# EAGLE design Teilentwurf (EAGLE 6.5.0)
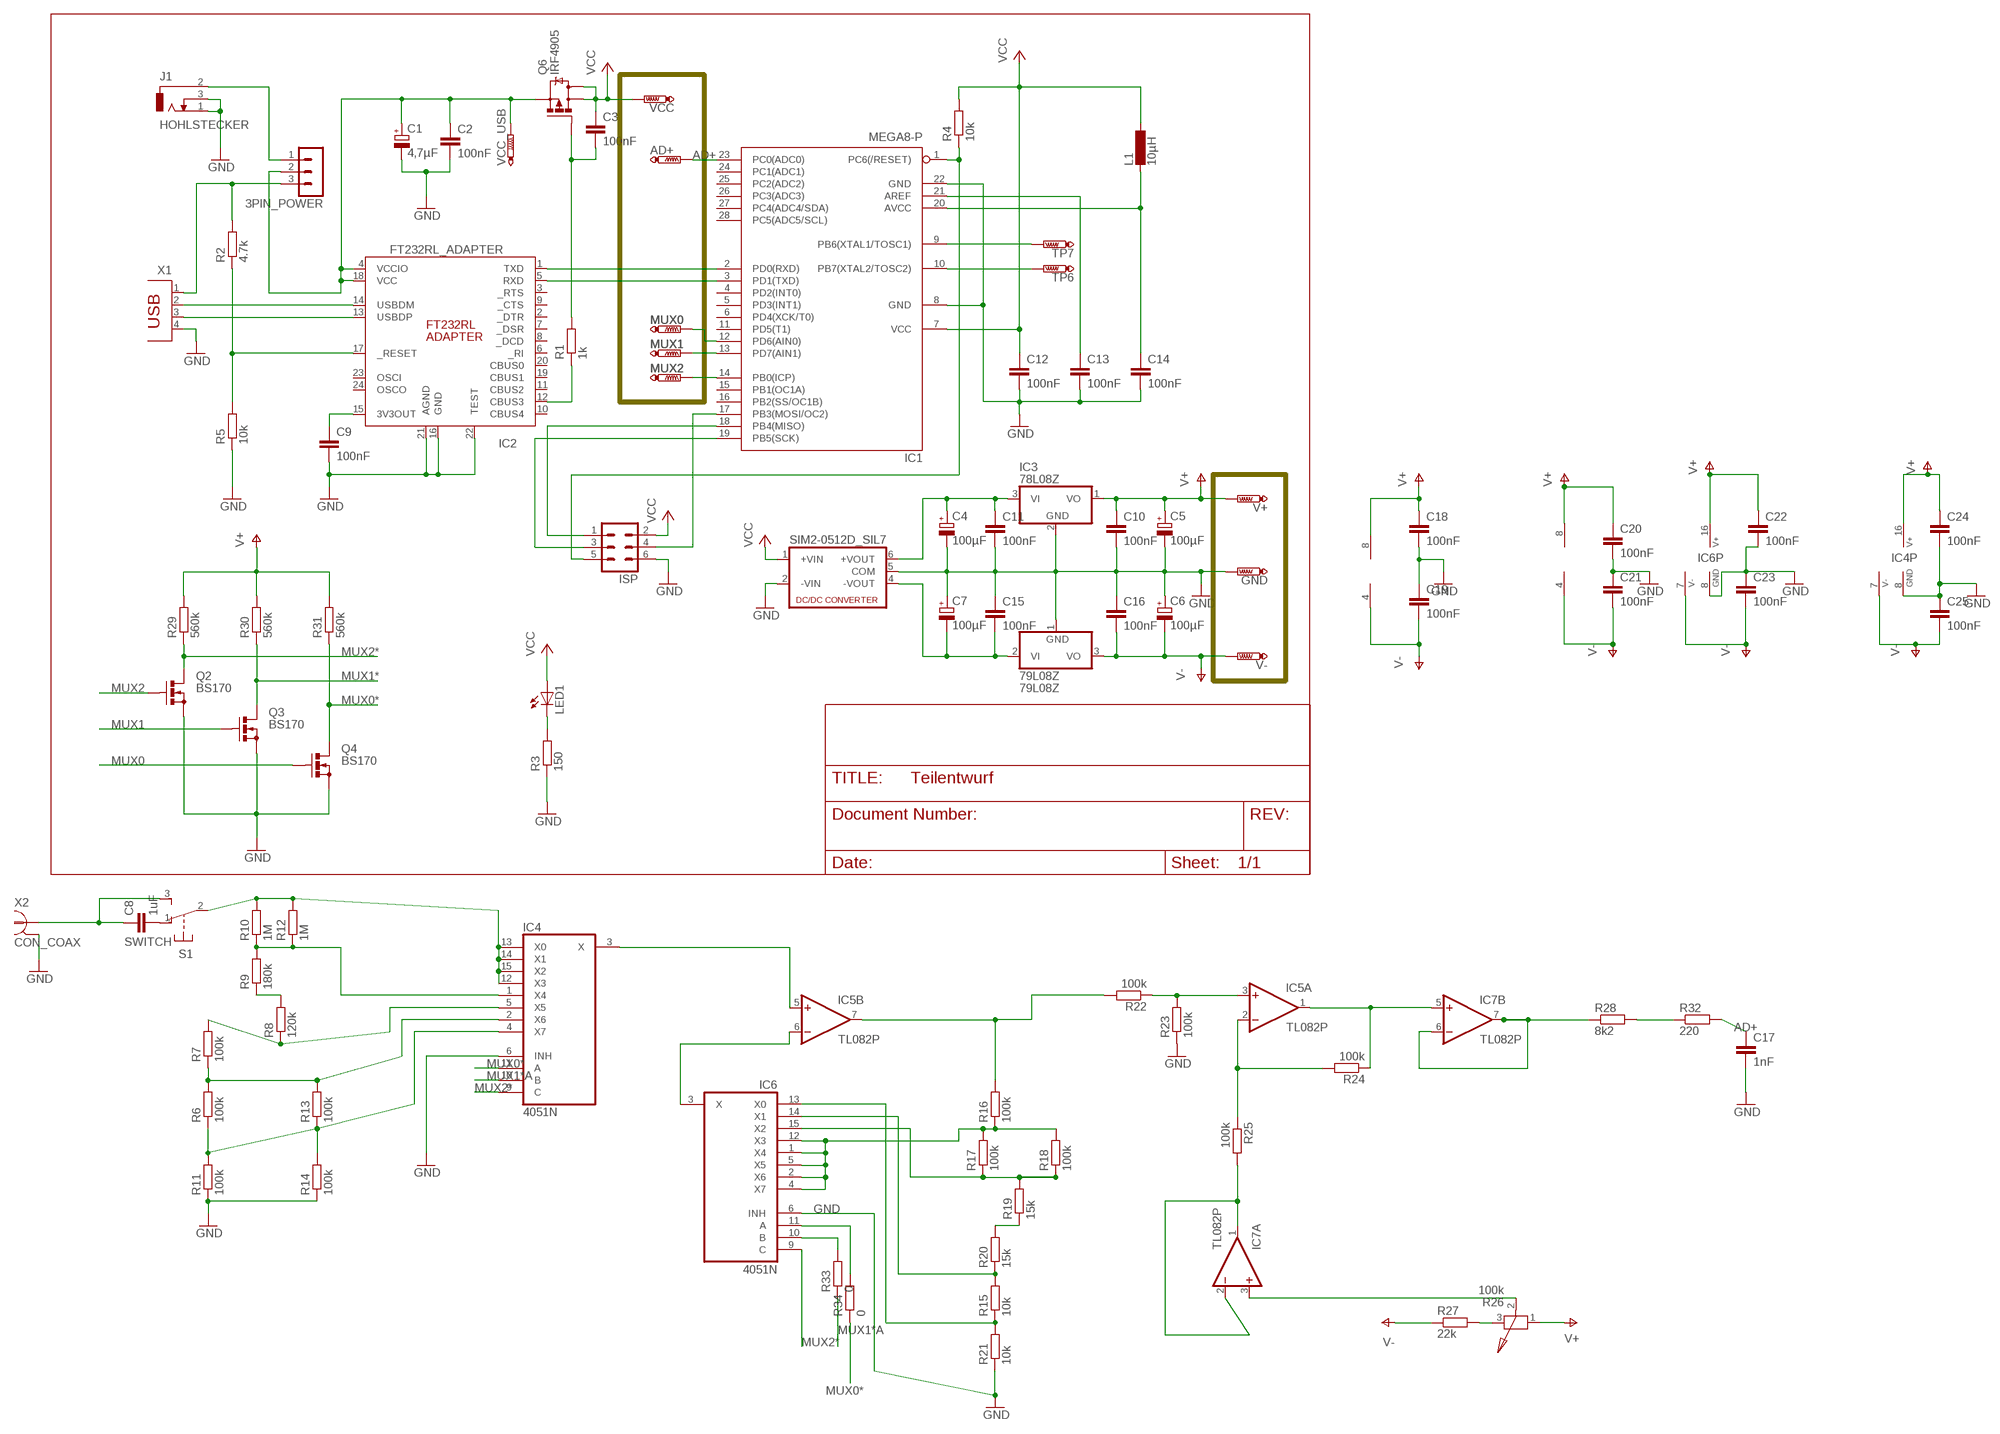
[diagram p0: schematic, sheet 1]

## Parts
3PIN_POWER  MA03-1  [MA03-1]
79L08Z  79L08Z  [TO92]
AD+  PTR1PAD1-13Y  [P1-13Y]
C1  4,7µF  CPOL-EUE2-5  [E2-5]
C2  100nF  C-EU025-030X050  [C025-030X050]
C3  100nF  C-EU025-030X050  [C025-030X050]
C4  100µF  CPOL-EUE2.5-7  [E2,5-7]
C5  100µF  CPOL-EUE2.5-7  [E2,5-7]
C6  100µF  CPOL-EUE2.5-7  [E2,5-7]
C7  100µF  CPOL-EUE2.5-7  [E2,5-7]
C8  1uF  C-EU050-050X075  [C050-050X075]
C9  100nF  C-EU025-030X050  [C025-030X050]
C10  100nF  C-EU025-030X050  [C025-030X050]
C11  100nF  C-EU025-030X050  [C025-030X050]
C12  100nF  C-EU025-030X050  [C025-030X050]
C13  100nF  C-EU025-030X050  [C025-030X050]
C14  100nF  C-EU025-030X050  [C025-030X050]
C15  100nF  C-EU025-030X050  [C025-030X050]
C16  100nF  C-EU025-030X050  [C025-030X050]
C17  1nF  C-EU025-030X050  [C025-030X050]
C18  100nF  C-EU025-030X050  [C025-030X050]
C19  100nF  C-EU025-030X050  [C025-030X050]
C20  100nF  C-EU025-030X050  [C025-030X050]
C21  100nF  C-EU025-030X050  [C025-030X050]
C22  100nF  C-EU025-030X050  [C025-030X050]
C23  100nF  C-EU025-030X050  [C025-030X050]
C24  100nF  C-EU025-030X050  [C025-030X050]
C25  100nF  C-EU025-030X050  [C025-030X050]
GND  PTR1PAD1-13Y  [P1-13Y]
IC1  MEGA8-P  [DIL28-3]
IC2  FT232RL_ADAPTER  [DIL24-9]
IC3  78L08Z  [TO92]
IC4  4051N  [DIL16]
IC5  TL082P  [DIL08]
IC6  4051N  [DIL16]
IC7  TL082P  [DIL08]
ISP  ML6  [ML6]
J1  HOHLSTECKER  [HOHLSTECKER_25]
L1  10µH  L-EU0207/12  [0207/12]
LED1  LED3MM  [LED3MM]
MUX0  PTR1PAD1-13Y  [P1-13Y]
MUX1  PTR1PAD1-13Y  [P1-13Y]
MUX2  PTR1PAD1-13Y  [P1-13Y]
Q2  BS170  [SOT54E]
Q3  BS170  [SOT54E]
Q4  BS170  [SOT54E]
Q6  IRF4905  IRF4905PBF  [TO220PAD]
R1  1k  R-EU_0207/10  [0207/10]
R2  4.7k  R-EU_0207/10  [0207/10]
R3  150  R-EU_0207/10  [0207/10]
R4  10k  R-EU_0207/12  [0207/12]
R5  10k  R-EU_0207/10  [0207/10]
R6  100k  R-EU_0207/10  [0207/10]
R7  100k  R-EU_0207/10  [0207/10]
R8  120k  R-EU_0207/10  [0207/10]
R9  180k  R-EU_0207/10  [0207/10]
R10  1M  R-EU_0207/10  [0207/10]
R11  100k  R-EU_0207/10  [0207/10]
R12  1M  R-EU_0207/10  [0207/10]
R13  100k  R-EU_0207/10  [0207/10]
R14  100k  R-EU_0207/10  [0207/10]
R15  10k  R-EU_0207/10  [0207/10]
R16  100k  R-EU_0207/10  [0207/10]
R17  100k  R-EU_0207/10  [0207/10]
R18  100k  R-EU_0207/10  [0207/10]
R19  15k  R-EU_0207/10  [0207/10]
R20  15k  R-EU_0207/10  [0207/10]
R21  10k  R-EU_0207/10  [0207/10]
R22  100k  R-EU_0207/10  [0207/10]
R23  100k  R-EU_0207/10  [0207/10]
R24  100k  R-EU_0207/10  [0207/10]
R25  100k  R-EU_0207/7  [0207/7]
R26  100k  POT  [POT]
R27  22k  R-EU_0207/10  [0207/10]
R28  8k2  R-EU_0207/10  [0207/10]
R29  560k  R-EU_0207/10  [0207/10]
R30  560k  R-EU_0207/10  [0207/10]
R31  560k  R-EU_0207/10  [0207/10]
R32  220  R-EU_0207/15  [0207/15]
R33  0  R-EU_0207/10  [0207/10]
R34  0  R-EU_0207/10  [0207/10]
S1  SWITCH  [APEM_5236]
SIM2-0512D_SIL7  NMA  [NMA]
TP6  PTR1PAD1-13Y  [P1-13Y]
TP7  PTR1PAD1-13Y  [P1-13Y]
V+  PTR1PAD1-13Y  [P1-13Y]
V-  PTR1PAD1-13Y  [P1-13Y]
VCC  PTR1PAD1-13Y  [P1-13Y]
VCC_USB  PTR1PAD1-13Y  [P1-13Y]
X1  USB_BUCHSE_B  [USB_BUCHSE_B]
X2  CON_COAX  [CON_COAX]

## Nets
AD+: AD+.TP C17.1 IC1.23(PC0(ADC0)) R32.2
AVCC: C14.1 IC1.20(AVCC) L1.2
GND: 79L08Z.1(GND) C1.- C2.2 C4.- C5.- C6.+ C7.+ C9.2 C10.2 C11.2 C12.2 C13.2 C14.2 C15.1 C16.1 C17.2 C18.2 C19.1 C20.2 C21.1 C22.2 C23.1 C24.2 C25.1 GND.TP IC1.8(GND) IC1.22(GND) IC2.16(GND) IC2.21(AGND) IC2.22(TEST) IC3.2(GND) IC4.6(INH) IC4.8(GND) IC6.6(INH) IC6.8(GND) ISP.6 J1.1 J1.3 Q2.S Q3.S Q4.S R3.1 R5.1 R11.1 R14.1 R21.1 R23.1 SIM2-0512D_SIL7.2(-VIN) SIM2-0512D_SIL7.5(COM) X1.4 X2.GND
MUX0: IC1.12(PD6(AIN0)) MUX0.TP Q4.G
MUX0*: IC4.11(A) Q4.D R31.1 R34.1
MUX1: IC1.13(PD7(AIN1)) MUX1.TP Q3.G
MUX1*: IC6.10(B) Q3.D R30.1 R33.2
MUX1*A: IC4.10(B) R33.1
MUX2: IC1.14(PB0(ICP)) MUX2.TP Q2.G
MUX2*: IC4.9(C) IC6.9(C) Q2.D R29.1
N$1: 3PIN_POWER.3 R2.2 X1.1
N$2: IC1.17(PB3(MOSI/OC2)) ISP.4
N$3: C9.1 IC2.15(3V3OUT)
N$4: IC1.2(PD0(RXD)) IC2.1(TXD)
N$5: C3.2 Q6.G R1.2
N$6: IC1.19(PB5(SCK)) ISP.3
N$7: IC2.14(USBDM) X1.2
N$8: IC2.13(USBDP) X1.3
N$9: IC1.3(PD1(TXD)) IC2.5(RXD)
N$10: IC2.12(CBUS3) R1.1
N$11: C4.+ C11.1 IC3.3(VI) SIM2-0512D_SIL7.6(+VOUT)
N$12: IC2.17(_RESET) R2.1 R5.2
N$13: IC4.2(X6) R6.2 R7.1 R13.2
N$14: 79L08Z.2(VI) C7.- C15.2 SIM2-0512D_SIL7.4(-VOUT)
N$15: IC1.18(PB4(MISO)) ISP.1
N$16: 3PIN_POWER.1 J1.2
N$17: IC4.5(X5) R7.2 R8.1
N$18: R8.2 R9.1
N$19: IC4.1(X4) R9.2 R10.1 R12.1
N$20: LED1.K(C) R3.2
N$21: C13.1 IC1.21(AREF)
N$22: IC4.4(X7) R6.1 R11.2 R13.1 R14.2
N$23: IC6.1(X4) IC6.2(X6) IC6.4(X7) IC6.5(X5) IC6.12(X3) R16.1 R17.2 R18.2
N$24: IC4.12(X3) IC4.13(X0) IC4.14(X1) IC4.15(X2) R10.2 R12.2 S1.2(P)
N$25: IC4.3(X) IC5.5(B:+IN)
N$26: IC5.6(B:-IN) IC6.3(X)
N$27: IC5.3(A:+IN) R22.1 R23.2
N$28: R19.1 R20.2
N$29: C8.2 S1.1(O)
N$30: C8.1 S1.3(S) X2.1
N$31: IC6.13(X0) R15.1 R21.2
N$32: IC6.14(X1) R15.2 R20.1
N$33: IC6.15(X2) R17.1 R18.1 R19.2
N$34: IC5.7(B:OUT) R16.2 R22.2
N$35: IC5.1(A:OUT) IC7.5(B:+IN) R24.1
N$36: IC5.2(A:-IN) R24.2 R25.1
N$37: IC7.1(A:OUT) IC7.2(A:-IN) R25.2
N$38: R26.3 R27.2
N$39: IC7.3(A:+IN) R26.2
N$40: IC7.6(B:-IN) IC7.7(B:OUT) R28.1
N$41: R28.2 R32.1
N$43: IC1.10(PB7(XTAL2/TOSC2)) TP6.TP
N$44: IC1.9(PB6(XTAL1/TOSC1)) TP7.TP
N$45: IC6.11(A) R34.2
RESET: IC1.1(PC6(/RESET)) ISP.5 R4.1
V+: C5.+ C10.1 C18.1 C20.1 C22.1 C24.1 IC3.1(VO) IC4.16(V+) IC5.8(P:V+) IC6.16(V+) IC7.8(P:V+) R26.1 R29.2 R30.2 R31.2 V+.TP
V-: 79L08Z.3(VO) C6.- C16.2 C19.2 C21.2 C23.2 C25.2 IC4.7(V-) IC5.4(P:V-) IC6.7(V-) IC7.4(P:V-) R27.1 V-.TP
VCC: C3.1 C12.1 IC1.7(VCC) ISP.2 L1.1 LED1.A Q6.D Q6.D2(D) R4.2 SIM2-0512D_SIL7.1(+VIN) VCC.TP
VCC_USB: 3PIN_POWER.2 C1.+ C2.1 IC2.4(VCCIO) IC2.18(VCC) Q6.S VCC_USB.TP
Unconnected: IC1.4(PD2(INT0)) IC1.5(PD3(INT1)) IC1.6(PD4(XCK/T0)) IC1.11(PD5(T1)) IC1.15(PB1(OC1A)) IC1.16(PB2(SS/OC1B)) IC1.24(PC1(ADC1)) IC1.25(PC2(ADC2)) IC1.26(PC3(ADC3)) IC1.27(PC4(ADC4/SDA)) IC1.28(PC5(ADC5/SCL)) IC2.2(_DTR) IC2.3(_RTS) IC2.6(_RI) IC2.7(_DSR) IC2.8(_DCD) IC2.9(_CTS) IC2.10(CBUS4) IC2.11(CBUS2) IC2.19(CBUS1) IC2.20(CBUS0) IC2.23(OSCI) IC2.24(OSCO)

## Power pins joined to a net without a drawn wire
GND: X2.G1(GND) X2.G2(GND)

## Library data of the parts
3PIN_POWER = 03_device-library:MA03-1: PIN HEADER
79L08Z = 03_device-library:79*: Negative VOLTAGE REGULATOR
AD+ GND MUX0 MUX1 MUX2 TP6 TP7 V+ V- VCC VCC_USB = 03_device-library:PTR1: TEST PIN
C1 C4-C7 = 03_device-library:CPOL-EU: POLARIZED CAPACITOR, European symbol
C2 C3 C8-C25 = 03_device-library:C-EU: CAPACITOR, European symbol
IC1 = 03_device-library:MEGA8-P: MICROCONTROLLER 8 Kbytes FLASH, 1 kbytes SRAM, 512 bytes EEPROM, USART, 4-channel 10 bit ADC, 2-channel 8 bit ADC Pin compatible with Atmega48, ATMega88, ATMega168 Source: avr.lbr
IC2 = 03_device-library:FT232RL_ADAPTER
IC3 = 03_device-library:78*: Positive VOLTAGE REGULATOR Source: http://cache.national.com/ds/LM/LM78L05.pdf http://www.fairchildsemi.com/ds/LM/LM7805.pdf
IC4 IC6 = 03_device-library:4051: 8-channel ANALOG MULTIPLEXER
IC5 IC7 = 03_device-library:TL082: OP AMP
ISP = 03_device-library:ML6: HARTING
J1 = 03_device-library:HOHLSTECKER: DC POWER JACK Source: DCJ0202.pdf
L1 = 03_device-library:L-EU: INDUCTOR, European symbol
LED1 = 03_device-library:LED: LED OSRAM: - CHIPLED LG R971, LG N971, LY N971, LG Q971, LY Q971, LO R971, LY R971 LH N974, LH R974 LS Q976, LO Q976, LY Q976 LO Q996 - Hyper CHIPLED LW Q18S LB Q993, LB Q99A, LB R99A - SideLED LS A670, LO A670, LY A670, LG A670, LP A670 LB A673, LV A673, LT A673, LW A673 LH A674 LY A675 LS A676, LA A676, LO A676, LY A676, LW A676 LS A679, LY A679, LG A679 - Hyper Micro SIDELED® LS Y876, LA Y876, LO Y876, LY Y876 LT Y87S - SmartLED LW L88C, LW L88S LB L89C, LB L89S, LG L890 LS L89K, LO L89K, LY L89K LS L896, LA L896, LO L896, LY L896 - TOPLED LS T670, LO T670, LY T670, LG T670, LP T670 LSG T670, LSP T670, LSY T670, LOP T670, LYG T670 LG T671, LOG T671, LSG T671 LB T673, LV T673, LT T673, LW T673 LH T674 LS T676, LA T676, LO T676, LY T676, LB T676, LH T676, LSB T676, LW T676 LB T67C, LV T67C, LT T67C, LS T67K, LO T67K, LY T67K, LW E67C LS E67B, LA E67B, LO E67B, LY E67B, LB E67C, LV E67C, LT E67C LW T67C LS T679, LY T679, LG T679 LS T770, LO T770, LY T770, LG T770, LP T770 LB T773, LV T773, LT T773, LW T773 LH T774 LS E675, LA E675, LY E675, LS T675 LS T776, LA T776, LO T776, LY T776, LB T776 LHGB T686 LT T68C, LB T68C - Hyper Mini TOPLED® LB M676 - Mini TOPLED Santana® LG M470 LS M47K, LO M47K, LY M47K Source: http://www.osram.convergy.de LUXEON: - LUMILED® LXK2-PW12-R00, LXK2-PW12-S00, LXK2-PW14-U00, LXK2-PW14-V00 LXK2-PM12-R00, LXK2-PM12-S00, LXK2-PM14-U00 LXK2-PE12-Q00, LXK2-PE12-R00, LXK2-PE12-S00, LXK2-PE14-T00, LXK2-PE14-U00 LXK2-PB12-K00, LXK2-PB12-L00, LXK2-PB12-M00, LXK2-PB14-N00, LXK2-PB14-P00, LXK2-PB14-Q00 LXK2-PR12-L00, LXK2-PR12-M00, LXK2-PR14-Q00, LXK2-PR14-R00 LXK2-PD12-Q00, LXK2-PD12-R00, LXK2-PD12-S00 LXK2-PH12-R00, LXK2-PH12-S00 LXK2-PL12-P00, LXK2-PL12-Q00, LXK2-PL12-R00 Source: www.luxeon.com KINGBRIGHT: KA-3528ASYC Source: www.kingbright.com
Q2-Q4 = 03_device-library:BS170: N-CHANNEL MOS FET
Q6 = 03_device-library:IRF4905: P-Channel HEXFET® Power MOSFET RDS(on)= 0.02 Ohm, ID = -74A Source: http://www.irf.com/product-info/datasheets/data/irf4905pbf.pdf
R1-R24 R27-R34 = 03_device-library:R-EU_: RESISTOR, European symbol
R25 = resistor:R-EU_: RESISTOR, European symbol
R26 = 03_device-library:POT: POTENTIOMETER
S1 = 03_device-library:SWITCH: MARQUARDT SWITCH
SIM2-0512D_SIL7 = 03_device-library:NMA: DC-DC CONVERTER
X1 = 03_device-library:USB_BUCHSE_B: BERG USB connector
X2 = 03_device-library:CON_COAX: Coaxial connector

## Board
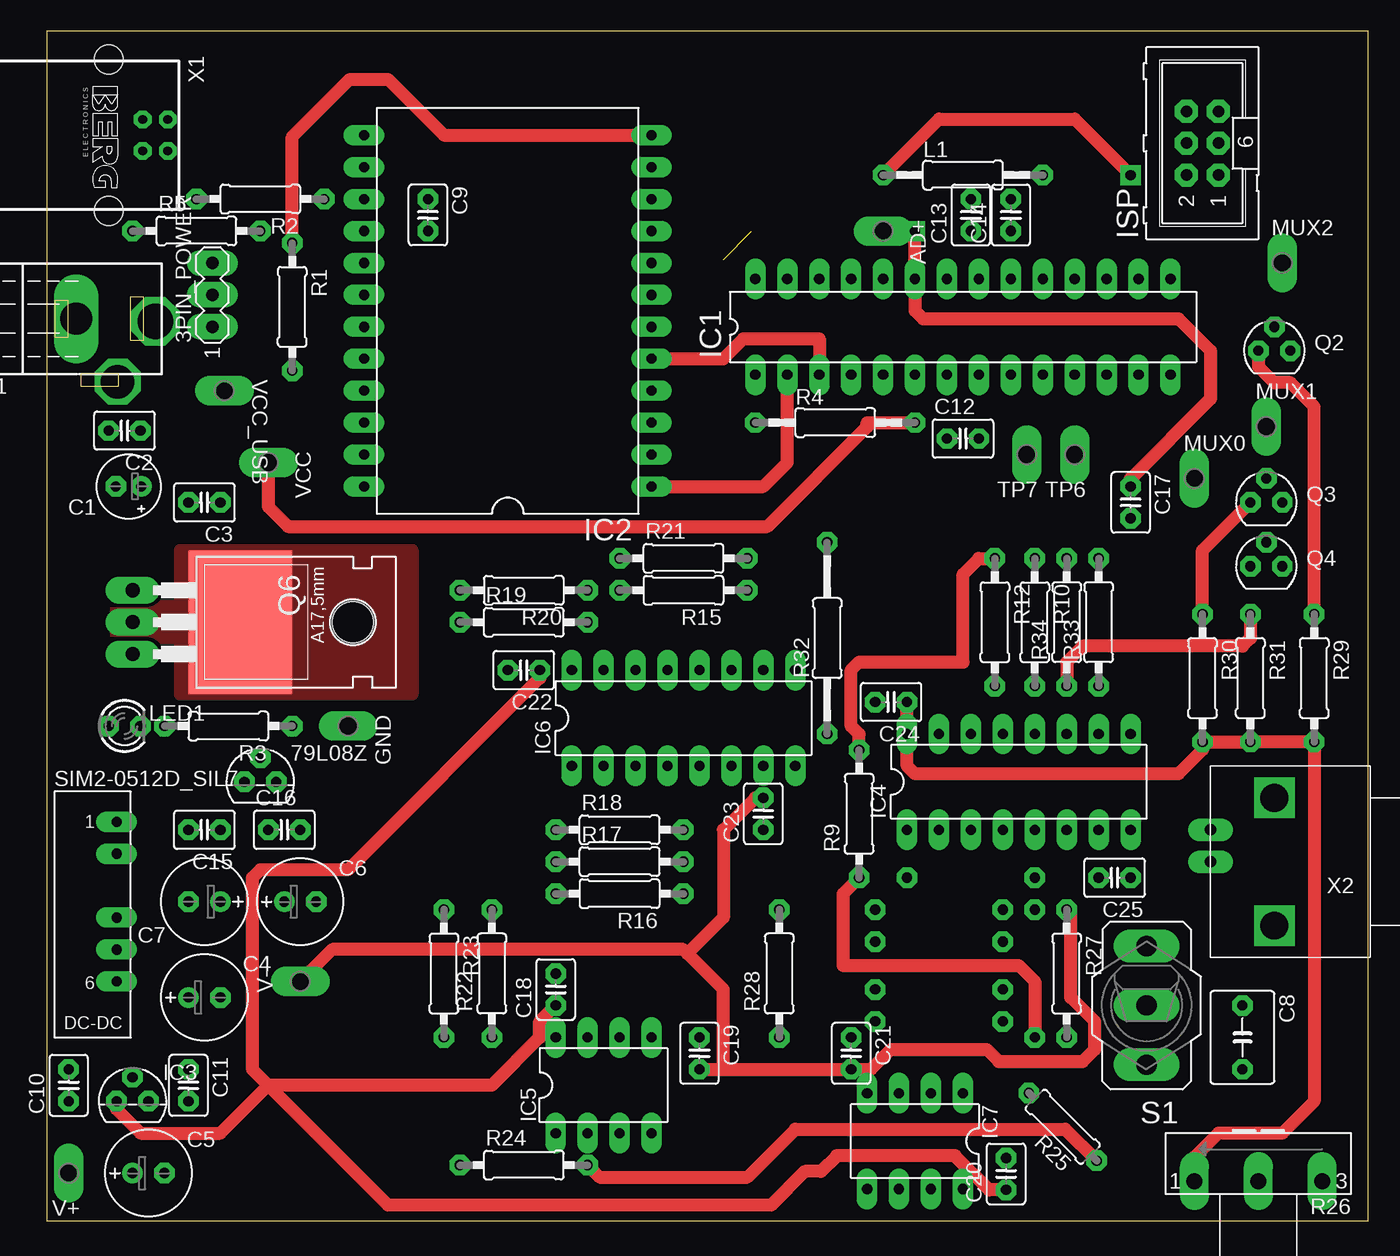
[diagram p1: board, top side]
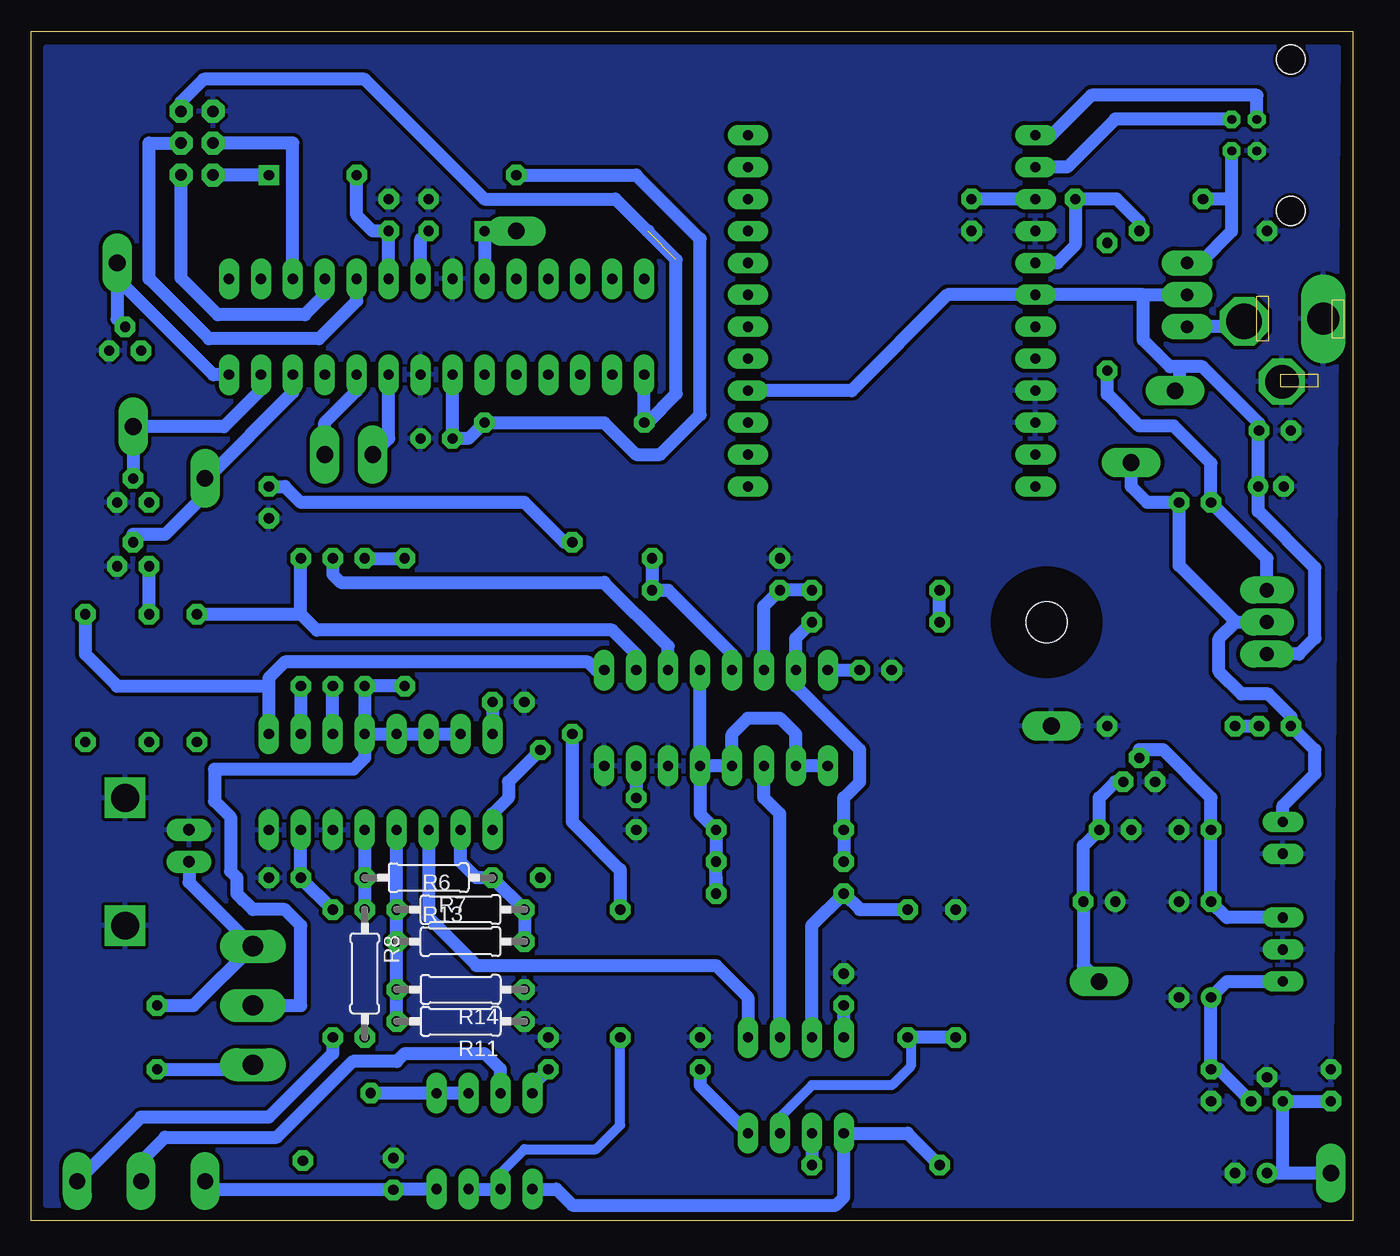
[diagram p2: board, bottom side, seen from below]

Size 105.08 x 94.61 mm. Coordinates in mm from the lower left corner, seen from the top.
Outline: 0,0 105.08,0 105.08,94.61 0,94.61 0,0
Copper layers (1*16): Top 0.035mm / dielectric 1.5mm / Bottom 0.035mm
Design rules "DesignRules_Grounplane *": minimum track width 0.8mm, minimum drill 0.7mm, track to track 0.3mm, track to pad 0.5mm, pad to pad 0.4mm, via to via 0.4mm, smd to smd 8mil, copper to edge 8mil, drill to drill 8mil, minimum pad ring 10mil, minimum via ring 10mil, stop-mask expansion 4mil, vias tented up to drill 0mil, thermal gap 10mil

### Footprints (pad centres in the part's own frame; a part is rotated, then mirrored left to right if it is on the bottom)
MA03-1 = drill 1.016 long: 1 -2.54,0; 2 0,0; 3 2.54,0
TO92 = drill 0.813 octagon: 1 -1.27,0; 2 0,1.905; 3 1.27,0
P1-13Y = drill 1.321 pad 1.905 long: TP 0,0
E2-5 = drill 0.813 pad 1.27: + -1.016,0 | drill 0.813 pad 1.27 octagon: - 1.016,0
C025-030X050 = drill 0.813 octagon: 1 -1.27,0; 2 1.27,0
E2,5-7 = drill 0.813 pad 1.6: + -1.27,0 | drill 0.813 pad 1.6 octagon: - 1.27,0
C050-050X075 = drill 0.813 octagon: 1 -2.54,0; 2 2.54,0
DIL28-3 = drill 0.813 long: 1 -16.51,-3.81; 2 -13.97,-3.81; 3 -11.43,-3.81; 4 -8.89,-3.81; 5 -6.35,-3.81; 6 -3.81,-3.81; 7 -1.27,-3.81; 8 1.27,-3.81; 9 3.81,-3.81; 10 6.35,-3.81; 11 8.89,-3.81; 12 11.43,-3.81; 13 13.97,-3.81; 14 16.51,-3.81; 15 16.51,3.81; 16 13.97,3.81; 17 11.43,3.81; 18 8.89,3.81; 19 6.35,3.81; 20 3.81,3.81; 21 1.27,3.81; 22 -1.27,3.81; 23 -3.81,3.81; 24 -6.35,3.81; 25 -8.89,3.81; 26 -11.43,3.81; 27 -13.97,3.81; 28 -16.51,3.81
DIL24-9 = drill 0.813 long: 1 -13.97,-11.43; 2 -11.43,-11.43; 3 -8.89,-11.43; 4 -6.35,-11.43; 5 -3.81,-11.43; 6 -1.27,-11.43; 7 1.27,-11.43; 8 3.81,-11.43; 9 6.35,-11.43; 10 8.89,-11.43; 11 11.43,-11.43; 12 13.97,-11.43; 13 13.97,11.43; 14 11.43,11.43; 15 8.89,11.43; 16 6.35,11.43; 17 3.81,11.43; 18 1.27,11.43; 19 -1.27,11.43; 20 -3.81,11.43; 21 -6.35,11.43; 22 -8.89,11.43; 23 -11.43,11.43; 24 -13.97,11.43
DIL16 = drill 0.813 long: 1 -8.89,-3.81; 2 -6.35,-3.81; 3 -3.81,-3.81; 4 -1.27,-3.81; 5 1.27,-3.81; 6 3.81,-3.81; 7 6.35,-3.81; 8 8.89,-3.81; 9 8.89,3.81; 10 6.35,3.81; 11 3.81,3.81; 12 1.27,3.81; 13 -1.27,3.81; 14 -3.81,3.81; 15 -6.35,3.81; 16 -8.89,3.81
DIL08 = drill 0.813 long: 1 -3.81,-3.81; 2 -1.27,-3.81; 3 1.27,-3.81; 4 3.81,-3.81; 5 3.81,3.81; 6 1.27,3.81; 7 -1.27,3.81; 8 -3.81,3.81
ML6 = drill 0.914 octagon: 1 -2.54,-1.27; 2 -2.54,1.27; 3 0,-1.27; 4 0,1.27; 5 2.54,-1.27; 6 2.54,1.27
HOHLSTECKER_25 = drill 2.54 pad 3.5 long: 1 0,2.5 | drill 2.822 octagon: 2 0.2,8.8 | drill 2.667 octagon: 3 5,5.8
0207/12 = drill 0.813 octagon: 1 -6.35,0; 2 6.35,0
LED3MM = drill 0.813 octagon: A -1.27,0; K 1.27,0
SOT54E = drill 0.813 octagon: D -1.27,0; G 0,1.905; S 1.27,0
TO220PAD = drill 1.118 long: D 0,-6.35; G -2.54,-6.35; S 2.54,-6.35 | smd 11.43 x 8.255: D2 0,2.223 | hole 3.302: 0,11.176
0207/10 = drill 0.813 octagon: 1 -5.08,0; 2 5.08,0
0207/7 = drill 0.813 octagon: 1 -3.81,0; 2 3.81,0
POT = drill 1.27 long: 1 -1.27,5.08; 2 -1.27,0; 3 -1.27,-5.08
0207/15 = drill 0.813 octagon: 1 -7.62,0; 2 7.62,0
APEM_5236 = drill 1.6 long: 1 0,4.713; 2 0,0; 3 0,-4.713
NMA = drill 0.813 long: 1 0,6.35; 2 0,3.81; 4 0,-1.27; 5 0,-3.81; 6 0,-6.35
USB_BUCHSE_B = drill 0.7 octagon: 1 1.25,4.71; 2 -1.25,4.71; 3 -1.25,2.71; 4 1.25,2.71 | hole 2.3: -6.02,0; 6.02,0
CON_COAX = drill 0.9 long: 1 0,0; GND 0,-2.54 | drill 2.2 square: G1 -5.08,5.08; G2 -5.08,-5.08

### Placement (x,y rotation side)
3PIN_POWER  13.17,73.66 90 top
79L08Z  16.98,34.92 0 top
AD+  66.51,78.73 270 top
C1  6.5,58.41 180 top
C2  6.18,62.86 180 top
C3  12.54,57.14 180 top
C4  12.54,17.77 0 top
C5  8.09,3.8 0 top
C6  20.16,25.39 0 top
C7  12.54,25.39 180 top
C8  95.08,14.6 270 top
C9  30.32,80.01 270 top
C10  1.74,10.79 90 top
C11  11.27,10.79 270 top
C12  72.86,62.23 0 top
C13  73.49,80.01 90 top
C14  76.67,80.01 90 top
C15  12.54,31.11 180 top
C16  18.89,31.11 0 top
C17  86.19,57.14 270 top
C18  40.48,18.41 90 top
C19  51.91,13.33 270 top
C20  76.29,3.74 90 top
C21  63.97,13.33 270 top
C22  37.94,43.81 180 top
C23  56.98,32.38 90 top
C24  67.14,41.27 180 top
C25  84.92,27.3 180 top
GND  23.96,39.37 270 top
IC1  72.86,71.12 0 top
IC2  36.66,72.39 90 top
IC3  6.82,9.52 0 top
IC4  77.3,34.92 0 top
IC5  44.29,10.79 0 top
IC6  50.63,40 0 top
IC7  69.05,6.35 180 top
ISP  91.91,85.72 90 top
J1  -0.17,71.75 270 top
L1  72.86,83.18 0 top
LED1  6.18,39.37 0 top
MUX0  91.27,59.05 0 top
MUX1  96.99,63.18 0 top
MUX2  98.26,76.2 0 top
Q2  97.62,69.21 0 top
Q3  96.99,57.14 0 top
Q4  96.99,52.06 0 top
Q6  13.17,47.62 270 top
R1  19.52,72.7 270 top
R2  16.98,81.28 180 top
R3  14.44,39.37 180 top
R4  62.7,63.49 0 top
R5  11.9,78.73 0 top
R6  70.95,24.76 0 bottom
R7  73.49,27.3 180 bottom
R8  78.57,19.68 270 bottom
R9  64.6,32.38 90 top
R10  78.57,47.62 270 top
R11  70.95,15.87 180 bottom
R12  75.4,47.62 270 top
R13  70.95,22.22 0 bottom
R14  70.95,18.41 180 bottom
R15  50.63,50.16 180 top
R16  45.55,26.03 180 top
R17  45.55,28.57 0 top
R18  45.55,31.11 0 top
R19  37.94,47.62 0 top
R20  37.94,50.16 180 top
R21  50.63,52.7 0 top
R22  35.4,19.68 90 top
R23  31.59,19.68 270 top
R24  37.94,4.44 0 top
R25  80.8,7.48 135 top
R26  96.35,4.44 90 top
R27  81.11,19.68 270 top
R28  58.26,19.68 90 top
R29  100.8,43.17 270 top
R30  91.91,43.17 270 top
R31  95.72,43.17 270 top
R32  62.06,46.35 90 top
R33  83.65,47.62 90 top
R34  81.11,47.62 90 top
S1  87.46,17.14 180 top
SIM2-0512D_SIL7  5.55,25.39 0 top
TP6  81.75,60.95 180 top
TP7  77.94,60.95 180 top
V+  1.74,3.8 180 top
V-  20.16,19.04 90 top
VCC  17.62,60.32 270 top
VCC_USB  14.12,66.04 270.1 top
X1  4.92,86.36 270 top
X2  92.54,28.57 180 top

### Tracks (layer width: path | path; a pad name or v marks a point on that pad's centre or on a via)
AD+  (via drill 0.8)
  Top 1.016: C17.1 86.19,59.05 92.54,65.4 92.54,69.21 90,71.75 69.68,71.75 69.05,72.39 IC1.23 v69.05,78.73
  Bottom 1.016: AD+.TP v69.05,78.73 IC1.23 | R32.2 62.7,53.97 65.88,57.14 83.65,57.14 84.92,58.41 C17.1
AVCC
  Bottom 1.016: IC1.20 C14.1 77.94,78.73 79.21,80.01 L1.2
GND
  pour Bottom (isolate 0.254, rank 2): 1.1,93.34 103.97,93.34 103.97,1.26 1.74,1.26
MUX0
  Bottom 1.016: IC1.12 84.29,65.92 91.16,59.05 MUX0.TP 91.27,57.78 94.45,54.6 96.99,54.6 Q4.G
MUX0*
  Top 1.016: R31.1 95.72,46.35 95.08,45.71 82.38,45.71 81.11,44.45 R34.1
  Bottom 1.016: R31.1 Q4.D | IC4.11 R34.1
MUX1
  Bottom 1.016: IC1.13 86.83,66.11 89.76,63.18 MUX1.TP | MUX1.TP 96.99,62.86 | MUX1.TP 96.99,63.49 | MUX1.TP Q3.G
MUX1*
  Top 1.016: R30.1 91.91,53.34 Q3.D
  Bottom 1.016: 83.65,48.25 82.38,46.98 58.89,46.98 56.98,45.08 IC6.10 | 83.65,48.25 R33.2 | R30.1 83.65,48.25
MUX1*A
  Bottom 1.016: R33.1 IC4.10
MUX2
  Bottom 1.016: IC1.14 90.61,67.31 98.26,74.95 MUX2.TP 98.26,71.75 Q2.G
MUX2*
  Top 1.016: R29.1 100.8,64.77 98.89,66.67 97.62,66.67 96.35,67.94 Q2.D
  Bottom 1.016: R29.1 100.8,45.08 98.26,42.54 86.19,42.54 | IC6.9 60.16,43.81 60.8,44.45 84.92,44.45 86.19,43.17 86.19,42.54 | 86.19,42.54 IC4.9
N$1
  Bottom 1.016: 3PIN_POWER.3 12.14,76.2 9.62,78.71 9.62,81.28 | 9.62,81.28 X1.1 | 9.62,81.28 R2.2
N$2
  Bottom 1.016: IC1.17 84.29,85.72 ISP.4
N$3
  Bottom 1.016: IC2.15 C9.1
N$4
  Top 1.016: IC1.2 58.89,60.32 56.98,58.41 IC2.1
N$5
  Bottom 1.016: Q6.G 6.82,52.7 C3.2 11.27,60.26 14.23,63.23 17.01,63.23 19.52,65.74 R1.2
N$6
  Bottom 1.016: IC1.19 79.21,73.16 82.2,70.16 90.96,70.16 95.72,74.93 95.72,85.72 ISP.3
N$7
  Bottom 1.016: X1.2 9.65,87.62 18.89,87.62 22.7,83.82 IC2.14
N$8
  Bottom 1.016: X1.3 7.62,89.53 20.79,89.53 23.96,86.36 IC2.13
N$9
  Top 1.016: IC2.5 53.81,68.58 55.4,70.16 61.43,70.16 IC1.3
N$10
  Top 1.016: IC2.12 31.59,86.36 27.14,90.8 24.1,90.8 19.52,86.22 R1.1
N$11
  Bottom 1.016: SIM2-0512D_SIL7.6 10,19.04 C4.+ C11.1 10.63,12.06 IC3.3
N$12
  Bottom 1.016: IC2.17 23.48,76.2 22.06,77.62 R2.1 18.78,81.28 16.98,79.48 R5.2
N$13
  Bottom 1.016: R13.2 R6.2 R7.1 69.68,27.3 70.95,28.57 IC4.2
N$14
  Bottom 1.016: SIM2-0512D_SIL7.4 10,24.12 C7.- C15.2 11.27,33.65 15.08,37.46 16.98,37.46 79L08Z.2
N$15
  Bottom 1.016: IC1.18 81.75,73.66 83.34,72.07 90.25,72.07 93.18,75 ISP.1
N$16
  Bottom 1.016: J1.2 9.07,71.12 3PIN_POWER.1
N$17
  Bottom 1.016: IC4.5 R7.2 R8.1
N$18
  Top 1.016: R9.1 63.34,26.03 63.34,20.31 77.3,20.31 78.57,19.04 R8.2
N$19
  Top 1.016: R9.2 64.6,38.73 63.97,39.37 63.97,43.81 64.6,44.45 72.86,44.45 72.86,51.43 74.13,52.7 R12.1
  Bottom 1.016: R10.1 R12.1 | R9.2 67.14,34.92 67.14,33.65 68.41,32.38 IC4.1
N$20
  Bottom 1.016: R3.2 LED1.K
N$21
  Bottom 1.016: IC1.21 74.13,78.1 C13.1
N$22
  Bottom 1.016: R11.2 R14.2 R13.1 R6.1 IC4.4
N$23
  Bottom 1.016: IC6.5 51.91,32.38 R18.2 R17.2 R16.1 50.63,27.3 | IC6.5 IC6.12 | IC6.1 IC6.2 44.29,38.73 45.55,40 48.09,40 49.37,38.73 IC6.4 IC6.5
N$24
  Bottom 1.016: R12.2 R10.2 IC4.12 | IC4.12 IC4.13 IC4.14 IC4.15 | IC4.12 78.57,36.82 79.46,35.94 90.51,35.94 90.51,33.4 89.24,32.13 89.24,27.81 88.73,27.3 88.73,26.03 87.46,24.76 84.92,24.76 83.65,23.49 83.65,17.14 S1.2
N$25
  Bottom 1.016: IC4.3 73.49,24.12 69.68,20.31 50.63,20.31 48.09,17.77 IC5.5
N$26
  Bottom 1.016: IC5.6 45.55,32.38 46.83,33.65 IC6.3
N$27
  Bottom 0.813: 35.14,14.6 35.14,12.31 36.66,10.79 43.02,10.79 45.55,8.25 IC5.3
  Bottom 1.016: R23.2 35.14,14.6 R22.1
N$28
  Bottom 1.016: R19.1 R20.2
N$29
  Bottom 1.016: C8.2 87.83,12.06 S1.1
N$30
  Bottom 1.016: C8.1 92.18,17.14 S1.3 92.54,26.93 X2.1
N$31
  Bottom 1.016: IC6.13 49.37,45.08 54.45,50.16 R15.1 R21.2
N$32
  Bottom 1.016: R20.1 R15.2 46.83,48.89 IC6.14
N$33
  Bottom 1.016: R17.1 R18.1 40.48,33.65 39.2,34.92 39.2,37.46 44.29,42.54 IC6.15 44.29,46.35 R19.2
N$34
  Bottom 1.016: IC5.7 43.02,23.49 R16.2 39.2,24.76 R22.2
N$35
  Bottom 1.016: R24.1 35.4,6.98 IC5.1 40.48,1.9 41.11,1.26 62.06,1.26 63.34,2.54 IC7.5
N$36
  Top 1.016: R25.1 80.98,7.3 59.52,7.3 55.72,3.49 43.97,3.49 R24.2
  Bottom 1.016: IC5.2 R24.2
N$37
  Bottom 1.016: IC7.2 71.27,10.16 | 71.27,10.16 IC7.1 | R25.2 71.29,10.18 71.27,10.16
N$38
  Bottom 1.016: R27.2 81.11,13.33 86.19,8.25 96.35,8.25 R26.3
N$39
  Bottom 1.016: IC7.3 67.78,12.06 69.05,13.33 75.4,13.33 76.03,12.7 79.53,12.7 85.56,6.66 94.45,6.66 96.35,4.76 96.35,4.44 96.35,3.8 R26.2
N$40
  Bottom 0.813: IC7.6 67.78,3.8 65.88,5.71 60.16,5.71 58.26,7.62 R28.1
  Bottom 1.016: IC7.7 IC7.6
N$41
  Bottom 1.016: R32.1 62.06,31.74 58.26,27.93 R28.2
N$43
  Bottom 1.016: IC1.10 79.21,66.04 81.75,63.49 TP6.TP
N$44
  Bottom 1.016: IC1.9 76.67,62.23 TP7.TP
N$45
  Bottom 1.016: R34.2 81.11,51.43 80.48,50.8 59.52,50.8 54.45,45.71 IC6.11
RESET  (1 unrouted)
  Bottom 1.016: IC1.1 R4.1 56.1,63.49 53.81,65.78 53.81,76.45 58.64,81.28 69.05,81.28 78.57,90.8 91.38,90.8 93.18,89 ISP.5 | 56.1,78.73 56.03,78.73
V+
  Top 1.016: 17.62,10.79 35.4,10.79 39.2,14.6 39.2,15.87 C18.1 | 17.62,10.79 13.81,6.98 7.46,6.98 5.55,8.88 IC3.1 | 17.62,10.79 16.35,12.06 16.35,27.3 16.98,27.93 23.96,27.93 39.2,43.17 C22.1 | 17.62,10.79 27.14,1.26 57.62,1.26 60.29,3.93 61.56,3.93 62.83,5.2 72.22,5.2 74.96,2.47 C20.1 | R26.1 91.27,5.07 93.18,6.98 98.26,6.98 100.8,9.52 R29.2 R31.2 R30.2 91.91,37.46 90,35.55 69.05,35.55 68.41,36.19 C24.1
  Bottom 0.813: 90.89,2.79 R26.1
  Bottom 1.016: V+.TP 5.55,3.8 | 5.55,3.8 C5.+ | C10.1 IC3.1 5.55,3.8 | IC6.16 C22.1 | C24.1 IC4.16 | IC7.8 76.23,2.54 C20.1 90.58,2.47 R26.1 | IC5.8 C18.1
V-
  Top 1.016: 53.81,12.06 53.81,18.41 50.95,21.27 | 50.95,21.27 50.63,21.58 22.7,21.58 V-.TP | C23.2 56.35,33.65 53.81,31.11 53.81,24.12 50.95,21.27 | C19.2 53.81,12.06 | 53.81,12.06 C21.2 65.56,12.06 67.14,13.65 74.77,13.65 75.72,12.7 82.38,12.7 83.34,13.65 83.34,15.87 81.43,17.77 81.43,24.44 R27.1
  Bottom 1.016: 79L08Z.3 18.89,34.92 20.16,33.65 C16.2 21.43,29.84 C6.- 21.43,20.31 V-.TP | IC6.7 C23.2 | R27.1 C25.2 IC4.7 | C19.2 51.91,10.79 IC5.4 | IC7.4 65.24,10.79 C21.2
VCC  (via drill 0.8)
  Top 1.016: v86.19,83.18 81.75,87.62 70.95,87.62 L1.1 | R4.2 65.24,63.49 65.24,63.18 57.3,55.24 19.19,55.24 17.62,56.81 VCC.TP
  Bottom 1.016: IC1.7 C12.1 70.32,62.23 R4.2 59.52,63.49 56.98,60.95 55.08,60.95 51.91,64.13 51.91,78.1 56.98,83.18 L1.1 | v86.19,83.18 ISP.2 | SIM2-0512D_SIL7.1 5.55,33.02 3.01,35.55 3.01,37.46 LED1.A 4.92,40.11 6.71,41.91 8.83,41.91 10.63,43.7 10.63,46.3 9.32,47.62 | 9.32,47.62 Q6.D | 9.32,47.62 13.81,52.11 C3.1 16.35,57.14 17.62,58.41 VCC.TP
  pour Top (no thermals): 10.63,53.34 29.05,53.34 29.05,41.91 10.63,41.91 10.63,46.35 5.55,46.35 5.55,48.89 10.63,48.89
VCC_USB
  Bottom 1.016: 16.66,73.66 IC2.18 32.22,73.66 39.84,66.04 IC2.4 | Q6.S 4.28,45.08 3.01,46.35 3.01,51.94 7.52,56.45 C1.+ 7.52,62.8 C2.1 7.46,63.45 11.95,67.94 13.81,67.94 | 13.81,67.94 14.53,67.94 16.66,70.07 16.66,73.66 | 16.66,73.66 3PIN_POWER.2 | VCC_USB.TP 13.81,66.04 13.81,67.94